# Altium schematic sheet 極限開關.SCHDOC
size A4
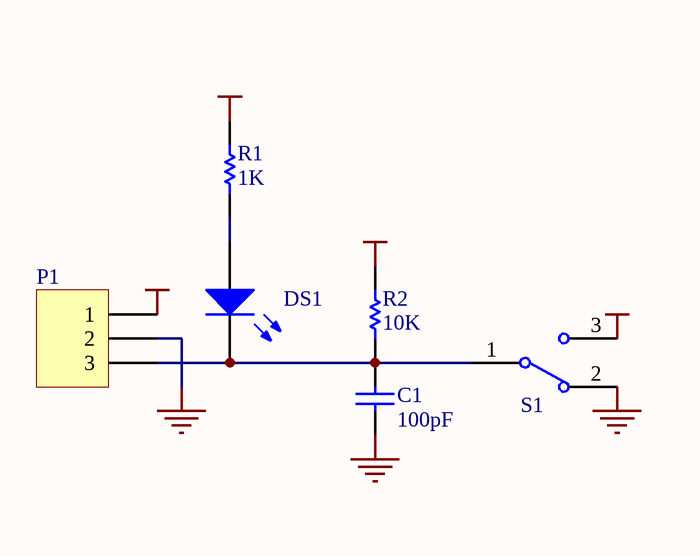
[diagram p0: 極限開關.SCHDOC]

## Parts
C1  value 100pF  [0805]  (hidden comment: Cap)
DS1  LED3  [SMD _LED]  (value not drawn)
P1  Header 3  [2mm 3pin]  (value not drawn)
R1  value 1K  [0805]  (hidden comment: Res1)
R2  value 10K  [0805]  (hidden comment: Res1)
S1  switch  [switch]  (value not drawn)

## Nets
GND: C1.1 P1.2 S1.2
VCC: P1.1 R1.2 R2.2 S1.3
NetC1_2: C1.2 DS1.2(K) P1.3 R2.1 S1.1
NetDS1_1: DS1.1(A) R1.1

## Library data of the parts
C1 = Cap: Capacitor; Published: 8-Jun-2000; LatestRevisionDate: 17-Jul-2002; LatestRevisionNote: Re-released for DXP Platform.; Publisher: Altium Limited
DS1 = LED3: Typical BLUE SiC LED; Published: 8-Jun-2000; LatestRevisionDate: 17-Dec-2003; LatestRevisionNote: PCB Footprint replaced.; Publisher: Altium Limited
P1 = Header 3: Header, 3-Pin; LatestRevisionDate: 17-Jul-2002; LatestRevisionNote: Re-released for DXP Platform.; Publisher: Altium Limited
R1 R2 = Res1: Resistor; Published: 8-Jun-2000; LatestRevisionDate: 17-Jul-2002; LatestRevisionNote: Re-released for DXP Platform.; Publisher: Altium Limited
S1 = switch: SPDT Subminiature Toggle Switch, Right Angle Mounting, Vertical Actuation; Revision 1: Jul-2002: Re-released for DXP Platform.; Revision 2: 17-Dec-2003: Schematic revised, PCB Footprint replaced.; Published: 24-Mar-1999; Datasheet: Latest Revision: 05-Dec-2000; Publisher: Altium Limited